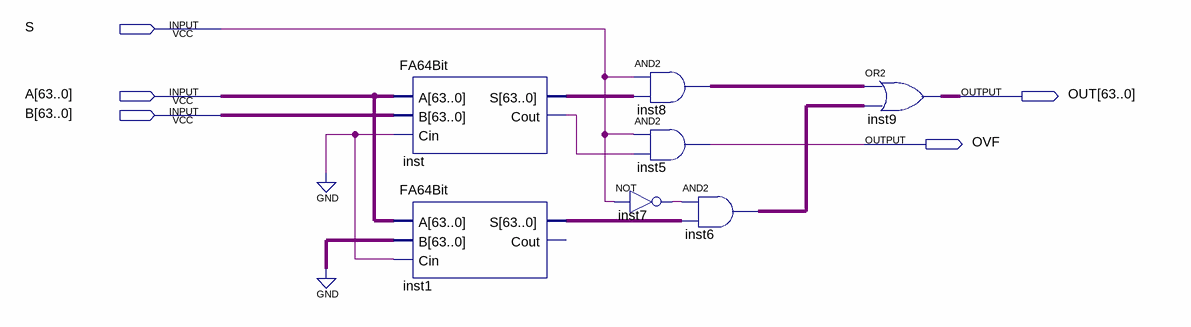
[diagram p0: schematic sheet]
// Quartus schematic MUL_ALU.bdf as structural Verilog: 7 symbols, 5 pins
module MUL_ALU (
  input  S,
  input  [63:0] A,
  input  [63:0] B,
  output [63:0] OUT,
  output OVF
);

  wire inst7_out, inst_cout;
  wire [63:0] inst1_s, inst6_out, inst8_out, inst_s;

  FA64Bit inst (.A(A), .B(B), .Cin(1'b0), .S(inst_s), .Cout(inst_cout));
  FA64Bit inst1 (.A(A), .B({64{1'b0}}), .Cin(1'b0), .S(inst1_s));  // open: Cout
  not inst7 (inst7_out, S);
  assign inst8_out = {64{S}} & inst_s;  // AND2 inst8, 64 bits wide
  and inst5 (OVF, S, inst_cout);
  assign inst6_out = {64{inst7_out}} & inst1_s;  // AND2 inst6, 64 bits wide
  assign OUT = inst8_out | inst6_out;  // OR2 inst9, 64 bits wide
endmodule
